# EAGLE design Placa_Rasp3 (EAGLE 9.1.3)
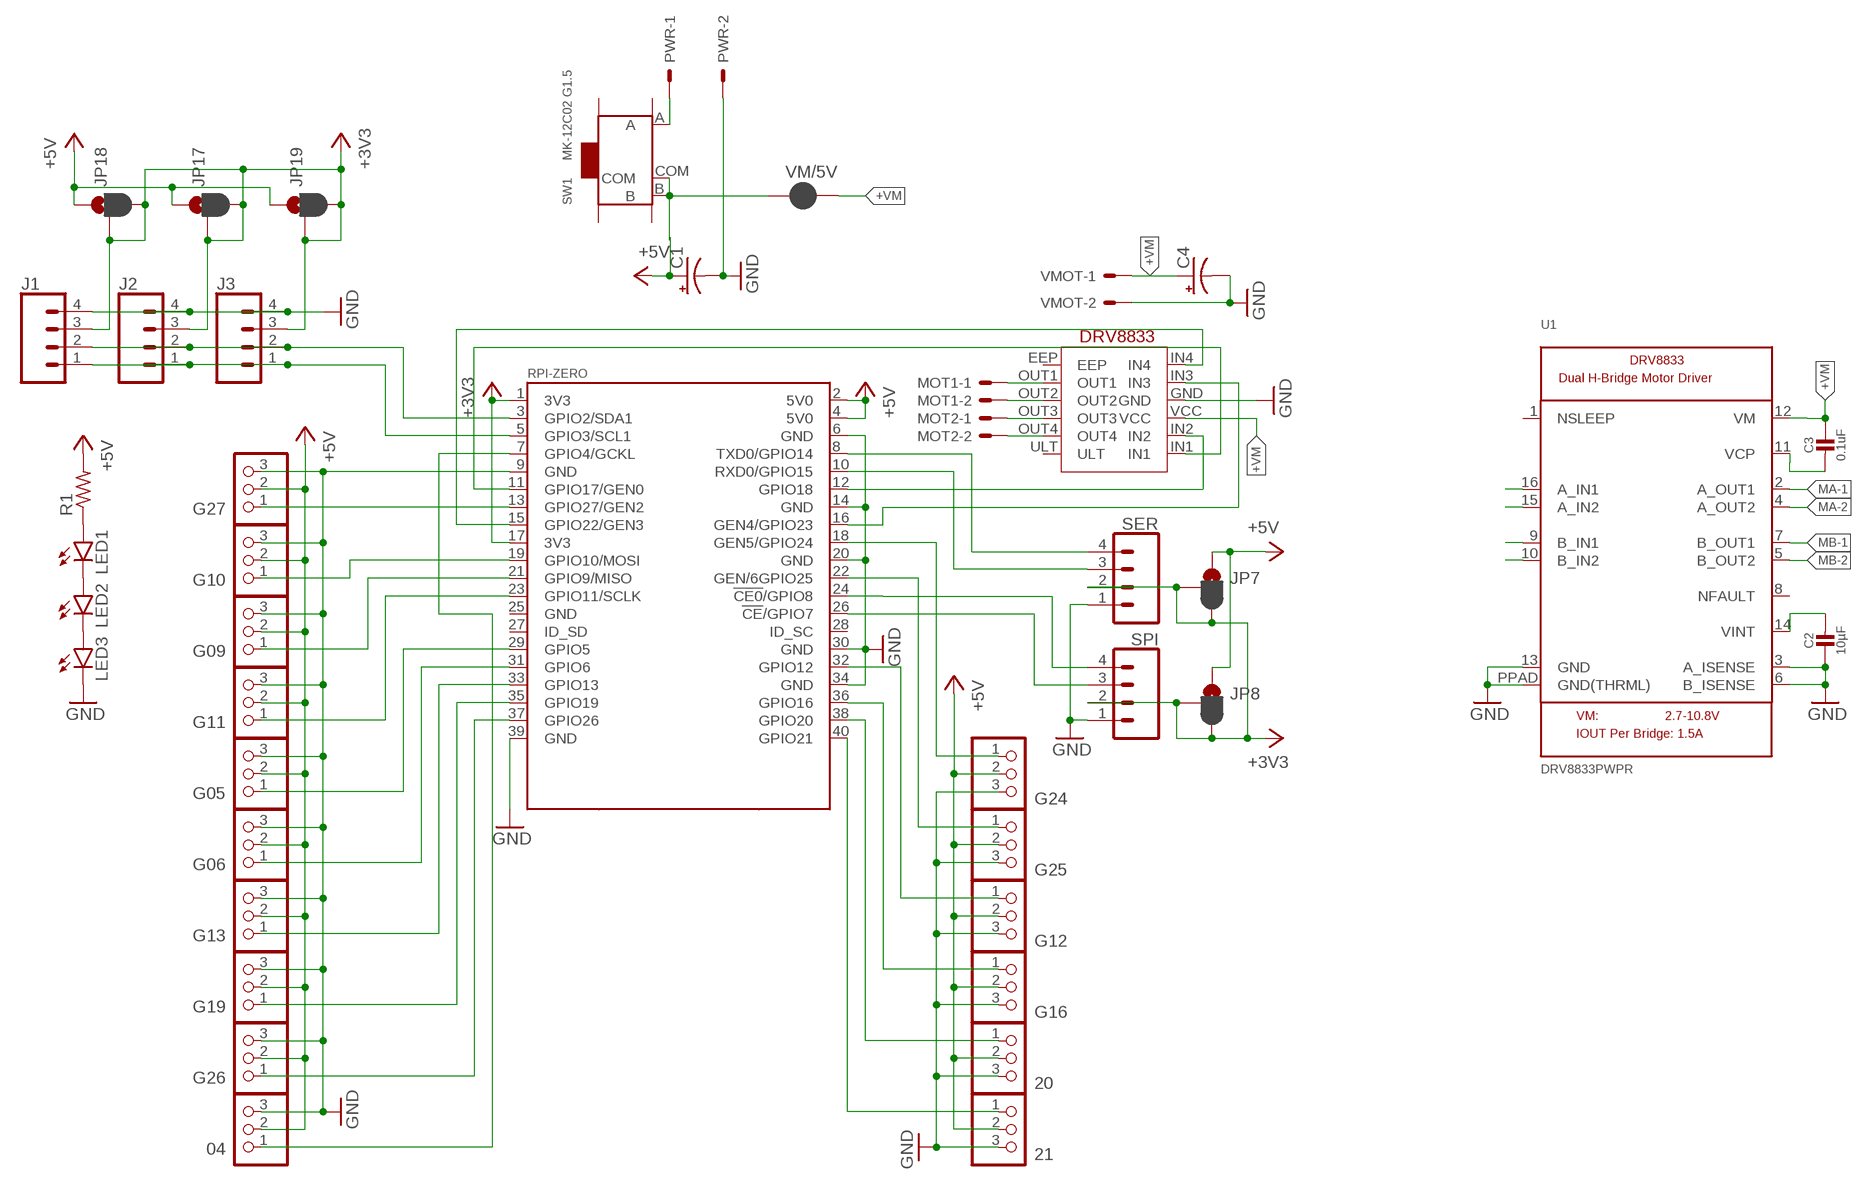
[diagram p0: schematic, sheet 1]

## Parts
04  PINHD-1X3  [1X03]
20  PINHD-1X3  [1X03]
21  PINHD-1X3  [1X03]
C1  CPOL-USE2,5-6E  [E2,5-6E]
C2  10µF  CAP_CERAMIC0805-NOOUTLINE  [0805-NO]
C3  0.1uF  CAP_CERAMIC0805-NOOUTLINE  [0805-NO]
C4  CPOL-USE2,5-6E  [E2,5-6E]
G05  PINHD-1X3  [1X03]
G06  PINHD-1X3  [1X03]
G09  PINHD-1X3  [1X03]
G10  PINHD-1X3  [1X03]
G11  PINHD-1X3  [1X03]
G12  PINHD-1X3  [1X03]
G13  PINHD-1X3  [1X03]
G16  PINHD-1X3  [1X03]
G19  PINHD-1X3  [1X03]
G24  PINHD-1X3  [1X03]
G25  PINHD-1X3  [1X03]
G26  PINHD-1X3  [1X03]
G27  PINHD-1X3  [1X03]
J1  CONN_04  [1X04]
J2  CONN_04  [1X04]
J3  CONN_04  [1X04]
JP7  JUMPER-SMT_3_1-NC_PASTE_SILK  [SMT-JUMPER_3_1-NC_PASTE_SILK]
JP8  JUMPER-SMT_3_1-NC_PASTE_SILK  [SMT-JUMPER_3_1-NC_PASTE_SILK]
JP17  JUMPER-SMT_3_1-NC_PASTE_SILK  [SMT-JUMPER_3_1-NC_PASTE_SILK]
JP18  JUMPER-SMT_3_1-NC_PASTE_SILK  [SMT-JUMPER_3_1-NC_PASTE_SILK]
JP19  JUMPER-SMT_3_1-NC_PASTE_SILK  [SMT-JUMPER_3_1-NC_PASTE_SILK]
LED1  LEDCHIP-LED0603  [CHIP-LED0603]
LED2  LEDCHIP-LED0603  [CHIP-LED0603]
LED3  LEDCHIP-LED0603  [CHIP-LED0603]
MOT1  JST-XH-02-PIN-LONG-PAD  [JST-XH-02-PACKAGE-LONG-PAD]
MOT2  JST-XH-02-PIN-LONG-PAD  [JST-XH-02-PACKAGE-LONG-PAD]
PWR  JST-XH-02-PIN-LONG-PAD  [JST-XH-02-PACKAGE-LONG-PAD]
R1  R-US_R0603  [R0603]
SER  CONN_04  [1X04]
SPI  CONN_04  [1X04]
SW1  MK-12C02 G1.5  SMD-TOGGLE-SWITCH-ON-ON(3+4P-6.7X2.7MM)  [SW7-SMD-L6.7X2.7X3.2MM]
U1  DRV8833PWPR  DRV8833  [HTSSOP16]
U$1  RPI-ZERO  [RASPBERRYPI_BASTELSTUBE_V13_RASPI_BOARD_B+_FULL]
U$3  DVR8833  [DRV8833]
VM/5V  JUMPER-SMT_2_NC_PASTE_SILK  [SMT-JUMPER_2_NC_PASTE_SILK]
VMOT  JST-XH-02-PIN-LONG-PAD  [JST-XH-02-PACKAGE-LONG-PAD]

## Nets
+3V3: J1.3 J2.3 J3.3 JP7.2 JP7.3 JP8.2 JP8.3 JP17.2 JP17.3 JP18.2 JP18.3 JP19.2 JP19.3 SER.2 SPI.2 U$1.1(3V3) U$1.17(3V3)
+5V: 04.2 20.2 21.2 C1.+ G05.2 G06.2 G09.2 G10.2 G11.2 G12.2 G13.2 G16.2 G19.2 G24.2 G25.2 G26.2 G27.2 JP7.1 JP8.1 JP17.1 JP18.1 JP19.1 R1.2 SW1.B SW1.COM U$1.2(5V0) U$1.4(5V0) VM/5V.1
+VM: C3.1 C4.+ U1.12(VM) U$3.VCC VM/5V.2 VMOT.1
CS0: SPI.4 U$1.24(!CE0!/GPIO8)
CS1: SPI.3 U$1.26(!CE!/GPIO7)
G17: U$1.11(GPIO17/GEN0) U$3.IN1
G18: U$1.12(GPIO18) U$3.IN2
G22: U$1.15(GPIO22/GEN3) U$3.IN4
G23: U$1.16(GEN4/GPIO23) U$3.IN3
GND: 04.3 20.3 21.3 C1.- C2.1 C4.- G05.3 G06.3 G09.3 G10.3 G11.3 G12.3 G13.3 G16.3 G19.3 G24.3 G25.3 G26.3 G27.3 J1.4 J2.4 J3.4 LED3.C PWR.2 SER.1 SPI.1 U1.3(A_ISENSE) U1.6(B_ISENSE) U1.13(GND) U1.PPAD(GND(THRML)) U$1.6(GND) U$1.9(GND) U$1.14(GND) U$1.20(GND) U$1.30(GND) U$1.34(GND) U$1.39(GND) U$3.GND VMOT.2
MA-1: MOT1.1 U1.2(A_OUT1) U$3.OUT1
MA-2: MOT1.2 U1.4(A_OUT2) U$3.OUT2
MB-1: MOT2.2 U1.7(B_OUT1) U$3.OUT4
MB-2: MOT2.1 U1.5(B_OUT2) U$3.OUT3
N$1: G26.1 U$1.37(GPIO26)
N$2: G24.1 U$1.18(GEN5/GPIO24)
N$3: G25.1 U$1.22(GEN/6GPIO25)
N$4: G12.1 U$1.32(GPIO12)
N$5: G16.1 U$1.36(GPIO16)
N$6: PWR.1 SW1.A
N$7: 20.1 U$1.38(GPIO20)
N$8: 21.1 U$1.40(GPIO21)
N$9: LED1.C LED2.A
N$10: LED2.C LED3.A
N$11: U1.16(A_IN1)
N$12: U1.15(A_IN2)
N$13: LED1.A R1.1
N$14: U1.9(B_IN1)
N$18: G27.1 U$1.13(GPIO27/GEN2)
N$19: G10.1 U$1.19(GPIO10/MOSI)
N$20: G11.1 U$1.23(GPIO11/SCLK)
N$21: G09.1 U$1.21(GPIO9/MISO)
N$22: G05.1 U$1.29(GPIO5)
N$23: G06.1 U$1.31(GPIO6)
N$24: G13.1 U$1.33(GPIO13)
N$25: G19.1 U$1.35(GPIO19)
N$26: 04.1 U$1.7(GPIO4/GCKL)
N$29: U1.10(B_IN2)
N$34: C2.2 U1.14(VINT)
N$35: C3.2 U1.11(VCP)
RX: SER.3 U$1.10(RXD0/GPIO15)
SCL: J1.1 J2.1 J3.1 U$1.5(GPIO3/SCL1)
SDA: J1.2 J2.2 J3.2 U$1.3(GPIO2/SDA1)
TX: SER.4 U$1.8(TXD0/GPIO14)
Unconnected: SW1.SS1 SW1.SS2 SW1.SS3 SW1.SS4 U1.1(NSLEEP) U1.8(NFAULT) U$1.25(GND) U$1.27(ID_SD) U$1.28(ID_SC) U$3.EEP U$3.ULT

## Library data of the parts
04 20 21 G05 G06 G09 G10-G13 G16 G19 G24-G27 = Placa_Rasp2:PINHD-1X3: PIN HEADER
C1 C4 = Placa_Rasp2:CPOL-US: POLARIZED CAPACITOR, American symbol; SPICEPREFIX: C
C2 C3 = Placa_Rasp2:CAP_CERAMIC: Ceramic Capacitors For new designs, use the packages preceded by an '_' character since they are more reliable: The following footprints should be used on most boards: _0402 - Standard footprint for regular board layouts _0603 - Standard footprint for regular board layouts _0805 - Standard footprint for regular board layouts _1206 - Standard footprint for regular board layouts For extremely tight-pitch boards where space is at a premium, the following 'micro-pitch' footprints can be used (smaller pads, no silkscreen outline, etc.): _0402MP - Micro-pitch footprint for very dense/compact boards _0603MP - Micro-pitch footprint for very dense/compact boards _0805MP - Micro-pitch footprint for very dense/compact boards _1206MP - Micro-pitch footprint for very dense/compact boards
J1-J3 SER SPI = Placa_Rasp2:CONN_04: Multi connection point. Often used as Generic Header-pin footprint for 0.1 inch spaced/style header connections On any of the 0.1 inch spaced packages, you can populate with these: Break Away Headers - Straight <https://www.sparkfun.com/products/116> (PRT-00116) Break Away Male Headers - Right Angle <https://www.sparkfun.com/products/553> (PRT-00553) Female Headers <https://www.sparkfun.com/products/115> (PRT-00115) Break Away Headers - Machine Pin <https://www.sparkfun.com/products/117> (PRT-00117) Break Away Female Headers - Swiss Machine Pin <https://www.sparkfun.com/products/743> (PRT-00743) For SCREWTERMINALS and SPRING TERMINALS visit here: Screw Terimnals on SparkFun.com <https://www.sparkfun.com/search/results?term=Screw+Terminals> (5mm/3.5mm/2.54mm spacing) This device is also useful as a general connection point to wire up your design to another part of your project. Our various solder wires solder well into these plated through hole pads. Hook-Up Wire - Assortment (Stranded, 22 AWG) <https://www.sparkfun.com/products/11375> (PRT-11375) Hook-Up Wire - Assortment (Solid Core, 22 AWG) <https://www.sparkfun.com/products/11367> (PRT-11367) View the entire wire category on our website here <https://www.sparkfun.com/categories/141> Special notes: Molex polarized connector foot print use with SKU : PRT-08231 with associated crimp pins and housings. 1MM SMD Version SKU: PRT-10208; PROD_ID: CONN-09696
JP7 JP8 JP17-JP19 = Placa_Rasp2:JUMPER-SMT_3_1-NC_PASTE: Normally closed solder jumper (1 of 2 connections) This jumper has an aperture in the stencil to allow solder paste to bridge one of the two connections. One connection is normally closed (NC), while the other is normally open (NO). Wick off the solder to open the connection. Reapply solder to reclose the connection. Apply solder to the other side instead to change the current path.
LED1-LED3 = led:LED: LED OSRAM: - CHIPLED LG R971, LG N971, LY N971, LG Q971, LY Q971, LO R971, LY R971 LH N974, LH R974 LS Q976, LO Q976, LY Q976 LO Q996 - Hyper CHIPLED LW Q18S LB Q993, LB Q99A, LB R99A - SideLED LS A670, LO A670, LY A670, LG A670, LP A670 LB A673, LV A673, LT A673, LW A673 LH A674 LY A675 LS A676, LA A676, LO A676, LY A676, LW A676 LS A679, LY A679, LG A679 - Hyper Micro SIDELED® LS Y876, LA Y876, LO Y876, LY Y876 LT Y87S - SmartLED LW L88C, LW L88S LB L89C, LB L89S, LG L890 LS L89K, LO L89K, LY L89K LS L896, LA L896, LO L896, LY L896 - TOPLED LS T670, LO T670, LY T670, LG T670, LP T670 LSG T670, LSP T670, LSY T670, LOP T670, LYG T670 LG T671, LOG T671, LSG T671 LB T673, LV T673, LT T673, LW T673 LH T674 LS T676, LA T676, LO T676, LY T676, LB T676, LH T676, LSB T676, LW T676 LB T67C, LV T67C, LT T67C, LS T67K, LO T67K, LY T67K, LW E67C LS E67B, LA E67B, LO E67B, LY E67B, LB E67C, LV E67C, LT E67C LW T67C LS T679, LY T679, LG T679 LS T770, LO T770, LY T770, LG T770, LP T770 LB T773, LV T773, LT T773, LW T773 LH T774 LS E675, LA E675, LY E675, LS T675 LS T776, LA T776, LO T776, LY T776, LB T776 LHGB T686 LT T68C, LB T68C - Hyper Mini TOPLED® LB M676 - Mini TOPLED Santana® LG M470 LS M47K, LO M47K, LY M47K Source: http://www.osram.convergy.de LUXEON: - LUMILED® LXK2-PW12-R00, LXK2-PW12-S00, LXK2-PW14-U00, LXK2-PW14-V00 LXK2-PM12-R00, LXK2-PM12-S00, LXK2-PM14-U00 LXK2-PE12-Q00, LXK2-PE12-R00, LXK2-PE12-S00, LXK2-PE14-T00, LXK2-PE14-U00 LXK2-PB12-K00, LXK2-PB12-L00, LXK2-PB12-M00, LXK2-PB14-N00, LXK2-PB14-P00, LXK2-PB14-Q00 LXK2-PR12-L00, LXK2-PR12-M00, LXK2-PR14-Q00, LXK2-PR14-R00 LXK2-PD12-Q00, LXK2-PD12-R00, LXK2-PD12-S00 LXK2-PH12-R00, LXK2-PH12-S00 LXK2-PL12-P00, LXK2-PL12-Q00, LXK2-PL12-R00 Source: www.luxeon.com KINGBRIGHT: KA-3528ASYC Source: www.kingbright.com
MOT1 MOT2 PWR VMOT = Placa_Rasp2:JST-XH-02-PIN: JST XH Connector 2 Pin Wire to board connector. Pitch: 2,54 mm, (0.100") Number of pins: 2 Created by Rembrandt Electronics www.rembrandtelectronics.com
R1 = rcl:R-US_: RESISTOR, American symbol; SPICEPREFIX: R
SW1 = Placa_Rasp2:SMD-TOGGLE-SWITCH-ON-ON(3+4P-6.7X2.7MM): 311030001; MPN: MK-12C02 G1.5
U1 = Placa_Rasp2:DRV8833: DRV8833 Dual H-Bridge Motor Driver -- HTSSOP Package
U$1 = Placa_Rasp2:RPI-ZERO
U$3 = Placa_Rasp2:DVR8833
VM/5V = Placa_Rasp2:JUMPER-SMT_2_NC_PASTE: Normally closed solder jumper This jumper has an aperture in the stencil to allow solder paste to bridge the split in the wire so it's normally closed (NC). Wick off the solder to open the connection. Reapply solder to reclose the connection.

## Board
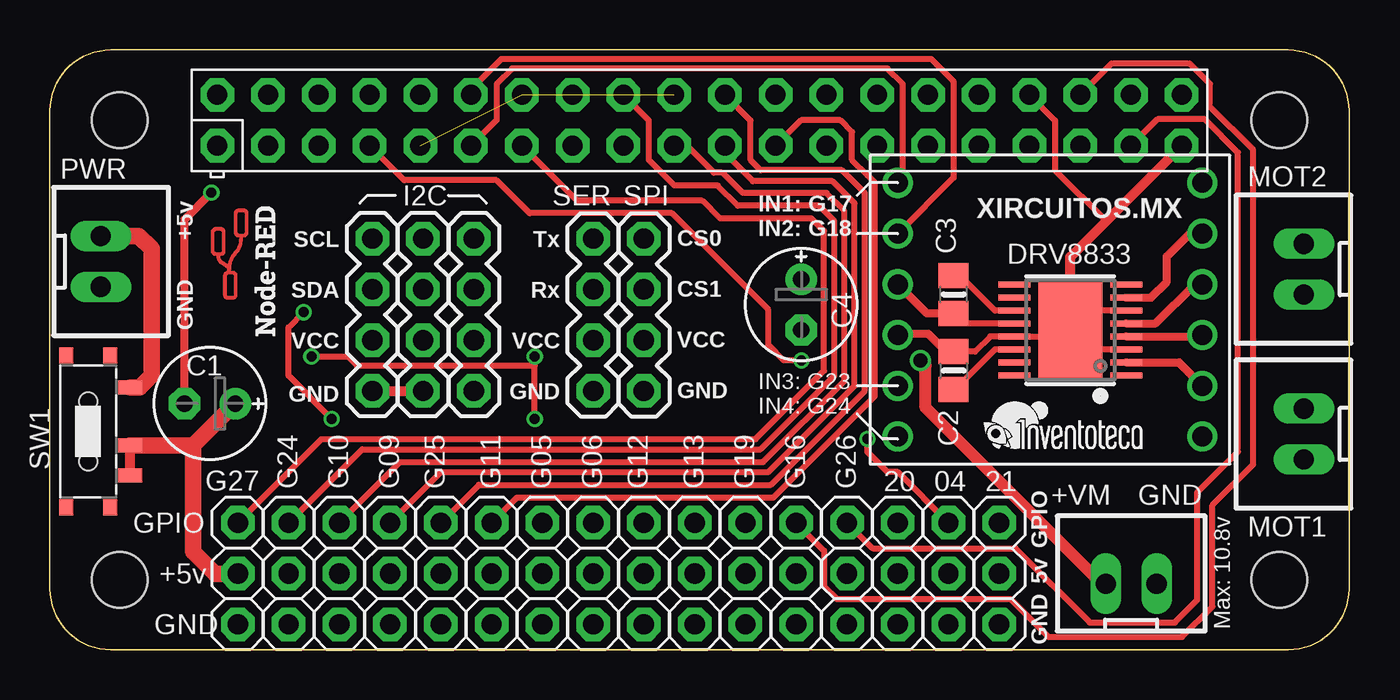
[diagram p1: board, top side]
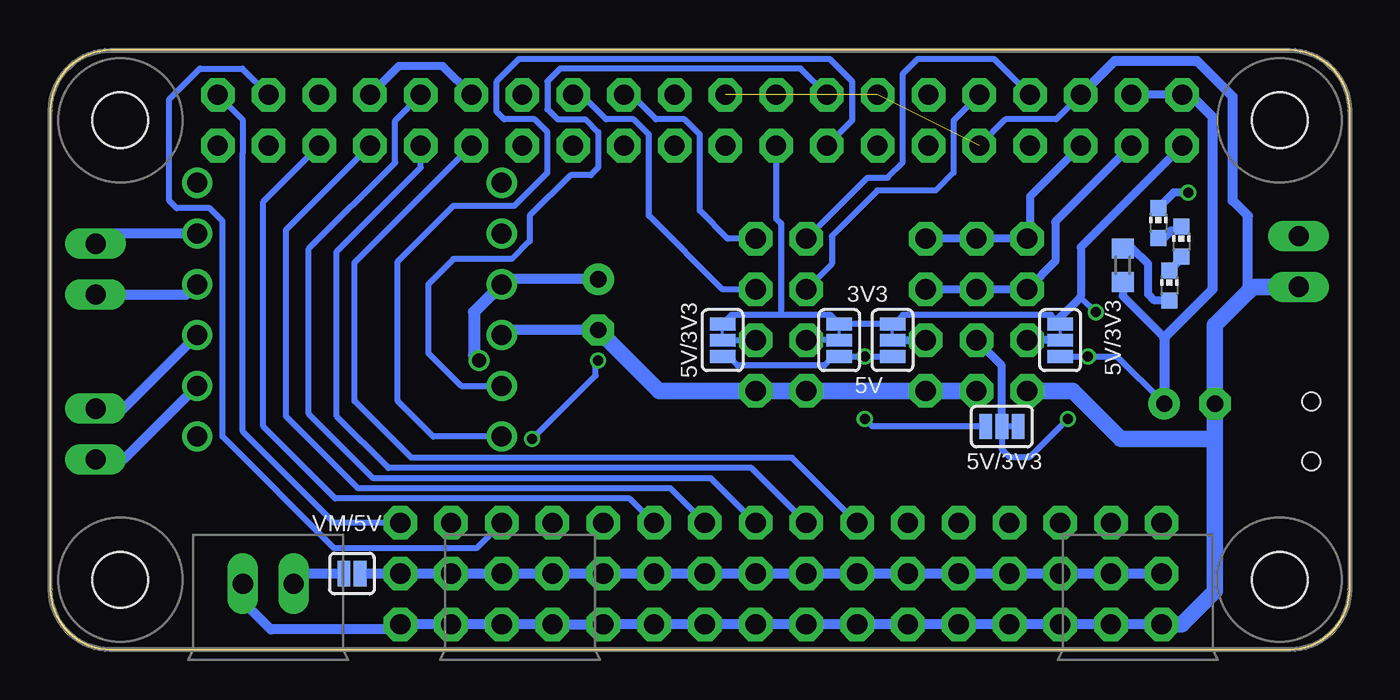
[diagram p2: board, bottom side, seen from below]

Size 65 x 30.02 mm. Coordinates in mm from the lower left corner, seen from the top.
Outline: 3.05,0 61.95,0 arc90 65,3.05 65,26.97 arc90 61.95,30.02 3.05,30.02 arc90 0,26.97 0,3.05 arc90 3.05,0
Copper layers (1*16): Top 0.035mm / dielectric 1.5mm / Bottom 0.035mm
Design rules "_xircuitos.mx_2L_DRC": minimum track width 6mil, minimum drill 12mil, track to track 6mil, track to pad 6mil, pad to pad 6mil, via to via 6mil, smd to smd 0mil, copper to edge 10mil, drill to drill 12mil, minimum pad ring 10mil, minimum via ring 6mil, stop-mask expansion 2mil, vias tented up to drill 100mil, thermal gap 10mil
Holes 2.8 mm at 3.5,26.5 3.5,3.5 61.5,26.5 61.5,3.5

### Footprints (pad centres in the part's own frame; a part is rotated, then mirrored left to right if it is on the bottom)
1X03 = drill 1.016 pad 1.676 octagon: 1 -2.54,0; 2 0,0; 3 2.54,0
E2,5-6E = drill 0.813 pad 1.575: + -1.27,0 | drill 0.813 pad 1.575 octagon: - 1.27,0
0805-NO = smd 1.24 x 1.5: 1 -0.95,0; 2 0.95,0
1X04 = drill 1.016 pad 1.676 octagon: 1 0,0; 2 2.54,0; 3 5.08,0; 4 7.62,0
SMT-JUMPER_3_1-NC_PASTE_SILK = smd 0.635 x 1.27: 1 -0.813,0; 2 0,0; 3 0.813,0
CHIP-LED0603 = smd 0.8 x 0.8: A 0,-0.75; C 0,0.75
JST-XH-02-PACKAGE-LONG-PAD = drill 1.016 long: 1 -1.27,0; 2 1.27,0
R0603 = smd 1 x 1.1: 1 -0.85,0; 2 0.85,0
SW7-SMD-L6.7X2.7X3.2MM = smd 1.2 x 0.7: A 2.1,2.2; B 2.1,-2.2; COM 2.1,-0.7 | smd 0.7 x 0.8: SS1 -1.1,-3.8; SS2 1.1,-3.8; SS3 1.1,3.8; SS4 -1.1,3.8 | hole 0.9: 0,-1.5; 0,1.5
HTSSOP16 = smd 0.3 x 1.6: 1 -2.275,-2.8; 2 -1.625,-2.8; 3 -0.975,-2.8; 4 -0.325,-2.8; 5 0.325,-2.8; 6 0.975,-2.8; 7 1.625,-2.8; 8 2.275,-2.8; 9 2.275,2.8; 10 1.625,2.8; 11 0.975,2.8; 12 0.325,2.8; 13 -0.325,2.8; 14 -0.975,2.8; 15 -1.625,2.8; 16 -2.275,2.8 | smd 4.8 x 3.2: PPAD 0,0
RASPBERRYPI_BASTELSTUBE_V13_RASPI_BOARD_B+_FULL = drill 1 pad 1.676 octagon: 1 8.37,25.23; 2 8.37,27.77; 3 10.91,25.23; 4 10.91,27.77; 5 13.45,25.23; 6 13.45,27.77; 7 15.99,25.23; 8 15.99,27.77; 9 18.53,25.23; 10 18.53,27.77; 11 21.07,25.23; 12 21.07,27.77; 13 23.61,25.23; 14 23.61,27.77; 15 26.15,25.23; 16 26.15,27.77; 17 28.69,25.23; 18 28.69,27.77; 19 31.23,25.23; 20 31.23,27.77; 21 33.77,25.23; 22 33.77,27.77; 23 36.31,25.23; 24 36.31,27.77; 25 38.85,25.23; 26 38.85,27.77; 27 41.39,25.23; 28 41.39,27.77; 29 43.93,25.23; 30 43.93,27.77; 31 46.47,25.23; 32 46.47,27.77; 33 49.01,25.23; 34 49.01,27.77; 35 51.55,25.23; 36 51.55,27.77; 37 54.09,25.23; 38 54.09,27.77; 39 56.63,25.23; 40 56.63,27.77 | hole 2.75: 3.5,3.5; 3.5,26.5; 61.5,3.5; 61.5,26.5
DRV8833 = drill 1: EEP -7.62,5.08; GND 7.62,0; IN1 7.62,-7.62; IN2 7.62,-5.08; IN3 7.62,2.54; IN4 7.62,5.08; OUT1 -7.62,2.54; OUT2 -7.62,0; OUT3 -7.62,-2.54; OUT4 -7.62,-5.08; ULT -7.62,-7.62; VCC 7.62,-2.54
SMT-JUMPER_2_NC_PASTE_SILK = smd 0.635 x 1.27: 1 -0.406,0; 2 0.406,0

### Placement (x,y rotation side)
04  44.96,3.81 270 top
20  42.42,3.81 270 top
21  47.5,3.81 270 top
C1  8,12.32 180 top
C2  45.21,13.97 270 top
C3  45.21,17.78 90 top
C4  37.59,17.27 270 top
G05  24.64,3.81 270 top
G06  27.18,3.81 270 top
G09  17.02,3.81 270 top
G10  14.48,3.81 270 top
G11  22.1,3.81 270 top
G12  29.72,3.81 270 top
G13  32.26,3.81 270 top
G16  37.34,3.81 270 top
G19  34.8,3.81 270 top
G24  11.94,3.81 270 top
G25  19.56,3.81 270 top
G26  39.88,3.81 270 top
G27  9.4,3.81 270 top
J1  21.21,20.57 270 top
J2  18.67,20.57 270 top
J3  16.13,20.57 270 top
JP7  31.37,15.49 90 bottom
JP8  25.53,15.49 90 bottom
JP17  17.4,11.18 0 bottom
JP18  14.48,15.49 90 bottom
JP19  22.86,15.49 90 bottom
LED1  9.02,18.24 0 bottom
LED2  8.42,20.43 0 bottom
LED3  9.58,21.36 0 bottom
MOT1  62.74,10.79 90 top
MOT2  62.74,19.05 90 top
PWR  2.54,19.43 270 top
R1  11.35,19.24 270 bottom
SER  27.18,12.95 90 top
SPI  29.72,12.95 90 top
SW1  1.91,10.92 0 top
U1  51.05,16 90 top
U$1  0,0 0 top
U$3  50.04,15.75 180 top
VM/5V  49.91,3.81 180 bottom
VMOT  54.1,3.3 0 top

### Tracks (layer width: path | path; a pad name or v marks a point on that pad's centre or on a via)
+3V3  (via drill 0.5)
  Top 0.305: v14.1,11.56 11.94,13.72 11.94,16.13 v12.7,16.89
  Bottom 0.152: JP18.2 JP18.3 | JP19.2 22.86,16.26 JP19.3 | JP8.2 JP8.3 | JP7.2 JP7.3
  Bottom 0.305: JP18.3 14.64,16.47 14.94,16.76 22.35,16.76 22.86,16.26 | JP19.3 JP8.3 25.98,16.76 28.45,16.76 | JP7.3 30.91,16.76 28.45,16.76 | U$1.17 28.69,21.58 28.45,21.34 28.45,16.76 | JP17.3 JP17.2 17.4,10.03 17.02,9.65 16,9.65 v14.1,11.56 | v12.7,16.89 13.4,17.59 13.53,17.59 | JP7.2 SPI.2 | JP8.2 SER.2
  Bottom 0.406: JP18.2 J3.3 | JP19.2 J1.3 | JP17.2 17.4,14.22 J2.3 | 14.64,16.47 13.53,17.59 13.45,17.66 13.45,20.15 U$1.1
+5V  (via drill 0.5)
  Top 0.305: v24.26,11.56 24.26,14.22 | 24.26,14.22 v24.26,14.68 | v13.08,14.68 14.91,14.68 15.37,14.22 24.26,14.22
  Top 0.508: SW1.B SW1.COM
  Top 0.813: SW1.COM 7.17,10.22 | 7.17,10.22 C1.+ | 7.17,10.22 7.17,4.89 8.26,3.81 G27.2
  Bottom 0.305: JP7.1 31.06,14.68 30.61,14.22 26.29,14.22 25.83,14.68 JP8.1 v24.26,14.68 JP19.1 | JP18.1 v13.08,14.68 11.63,14.68 C1.+ | JP17.1 23.88,11.18 v24.26,11.56
  Bottom 0.406: U$1.2 U$1.4 | R1.2 11.35,17.7 9.27,15.62
  Bottom 0.508: G27.2 G24.2 G10.2 G09.2 G25.2 G11.2 G05.2 G06.2 G12.2 G13.2 G19.2 G16.2 G26.2 20.2 04.2 21.2 VM/5V.1 | U$1.2 7.96,27.77 6.86,26.67 6.86,18.03 9.27,15.62 C1.+
+VM  (via drill 0.7)
  Top 0.305: U1.12 45.72,16.33 C3.1
  Top 0.406: C3.1 43.88,16.83 U$3.VCC
  Top 0.61: v43.56,14.48 43.81,14.22 43.81,12.12 52.63,3.3 VMOT.1
  Bottom 0.406: 42.16,18.54 U$3.VCC
  Bottom 0.508: VM/5V.2 52.32,3.81 VMOT.1 | C4.+ 42.16,18.54
  Bottom 0.61: U$3.VCC 43.81,16.89 43.81,14.73 v43.56,14.48
CS0
  Bottom 0.305: SPI.4 31.11,20.57 32.51,21.97 32.51,25.78 33.27,26.54 34.7,26.54 35.93,27.77 U$1.24
CS1
  Bottom 0.305: SPI.3 31.37,18.03 35.05,21.72 35.05,25.78 35.81,26.54 37.2,26.54 38.43,27.77 U$1.26
G17
  Top 0.305: U$3.IN1 42.67,23.62 42.67,28.32 41.91,29.08 23.11,29.08 22.35,28.32 22.35,26.51 U$1.11
G18
  Top 0.305: U$1.12 21.07,28.05 22.59,29.58 44.08,29.58 45.21,28.45 45.21,23.62 U$3.IN2
G22
  Bottom 0.305: U$3.IN4 45.85,10.67 47.62,12.45 47.62,19.43 44.83,22.23 41.78,22.23 40.13,23.88 40.13,25.91 40.77,26.54 42.29,26.54 42.67,26.92 42.67,28.45 41.54,29.58 26.02,29.58 24.89,28.45 24.89,26.49 U$1.15
G23
  Bottom 0.305: U$1.16 27.46,29.08 39.5,29.08 40.13,28.45 40.13,27.05 39.62,26.54 38.23,26.54 37.59,25.91 37.59,24.13 37.97,23.75 38.99,23.75 41.02,21.72 41.02,20.45 41.91,19.56 44.83,19.56 46.1,18.29 46.1,14.86 44.45,13.21 U$3.IN3
GND  (via drill 0.5)  (2 unrouted)
  Top 0.305: U1.6 52.03,16.98 | U1.3 52.16,15.03 | U1.PPAD 50.73,15.68 U1.13 47.05,15.68 46.29,14.92 C2.1 | U$1.34 50.29,26.49 50.29,24 52.85,21.45
  Top 0.406: 52.03,16.98 51.12,16.07 | 51.12,16.07 U1.PPAD | 52.16,15.03 51.12,16.07 | C2.1 44.83,14.92 43.94,15.81 42.48,15.81 U$3.GND | C1.- 6.73,21.54 v8.08,22.89
  Top 0.508: J3.4 J2.4 | U1.PPAD 51.05,19.65 52.85,21.45 U$1.39
  Bottom 0.305: U$1.6 14.68,26.54 17.22,26.54 U$1.9
  Bottom 0.406: 42.16,16 U$3.GND | U$1.30 45.37,29.21 47.57,29.21 U$1.34 | v8.08,22.89 8.8,22.89 LED3.C
  Bottom 0.508: G27.3 G24.3 G10.3 G09.3 G25.3 G11.3 G05.3 G06.3 G12.3 G13.3 G19.3 G16.3 G26.3 20.3 04.3 21.3 47.75,1.02 53.98,1.02 55.37,2.41 VMOT.2 | C4.- 42.16,16 | U$1.6 11.75,29.47 11.74,29.46 7.62,29.46 5.84,27.69 5.84,22.48 5.08,21.72 5.08,17.91
  Bottom 0.813: 6.73,10.54 C1.- 6.73,16.26 5.08,17.91 4.83,18.16 PWR.2 | 6.73,10.54 6.73,2.92 8.38,1.27 G27.3 | 6.73,10.54 11.43,10.54 13.84,12.95 J3.4 | J2.4 J1.4 SPI.1 SER.1 34.54,12.95 C4.-
MA-1
  Top 0.406: U1.2 56.49,14.38 U$3.OUT1
  Bottom 0.508: U$3.OUT1 61.34,9.53 MOT1.1
MA-2
  Top 0.406: U1.4 57.59,15.68 U$3.OUT2
  Bottom 0.508: U$3.OUT2 61.34,12.06 MOT1.2
MB-1
  Top 0.406: U1.7 55.09,17.63 55.88,18.41 55.88,19.68 57.02,20.83 U$3.OUT4
  Bottom 0.508: U$3.OUT4 62.23,20.83 MOT2.2
MB-2
  Top 0.406: U1.5 55.32,16.33 57.28,18.29 U$3.OUT3
  Bottom 0.508: MOT2.1 58.17,17.78 U$3.OUT3
N$1
  Top 0.305: G26.1 41.15,5.08 48.31,5.08 52.02,1.37 56.29,1.37 57.4,2.49 57.4,7.87 59.44,9.91 59.44,24.89 57.78,26.54 55.4,26.54 U$1.37
N$2
  Top 0.305: G24.1 15.62,10.03 35.56,10.03 39.24,13.72 39.24,21.46 38.48,22.23 34.42,22.23 33.4,23.24 31.24,23.24 29.97,24.51 29.97,26.49 U$1.18
N$3
  Top 0.305: G25.1 21.46,8.26 36.07,8.26 40.77,12.95 40.77,18.8 40.77,20.32 40.77,22.86 39.62,24 35.56,24 35.05,24.51 35.05,26.49 U$1.22
N$4
  Bottom 0.305: G12.1 31.95,8.59 48.84,8.59 52.07,11.81 52.07,20.07 47.75,24.38 47.75,26.49 U$1.32
N$5
  Top 0.305: G16.1 38.73,4.95 38.73,3.17 39.37,2.54 48.06,2.54 49.96,0.64 56.64,0.64 58.17,2.16 58.17,7.24 60.2,9.27 60.2,25.02 58.04,27.18 58.04,28.32 57.02,29.34 53.12,29.34 U$1.36
N$6
  Top 0.813: SW1.A 4.49,13.12 5.08,13.72 5.08,20.07 4.45,20.7 PWR.1
N$7
  Bottom 0.305: 20.1 43.69,5.08 50.8,5.08 56.39,10.67 56.39,21.46 57.02,22.1 58.67,22.1 59.05,22.48 59.05,27.56 57.53,29.08 55.4,29.08 U$1.38
N$8
  Bottom 0.305: U$1.40 55.36,26.5 55.36,24.88 55.37,24.87 55.37,10.92 50.8,6.35 21.1
N$9
  Bottom 0.406: LED1.C 8.42,19.58 LED2.A
N$10
  Bottom 0.406: LED2.C 8.62,20.98 8.93,20.98 9.3,20.61 LED3.A
N$13
  Bottom 0.406: LED1.A 9.77,17.49 10.07,17.79 10.07,19.3 10.86,20.09 R1.1
N$18
  Top 0.305: G27.1 13.59,10.54 35.31,10.54 38.73,13.97 38.73,20.95 38.1,21.59 33.53,21.59 32.64,22.48 26.36,22.48 U$1.13
N$19
  Top 0.305: G10.1 17.53,9.4 35.69,9.4 39.75,13.46 39.75,21.97 38.86,22.86 34.67,22.86 33.66,23.88 33.22,23.88 31.86,25.23 U$1.19
N$20
  Top 0.305: G11.1 23.37,7.62 36.2,7.62 41.27,12.7 41.27,23.19 41.27,23.37 40.89,23.75 40.13,24.51 40.13,25.91 39.54,26.5 37.58,26.5 U$1.23
N$21
  Top 0.305: G09.1 19.56,8.89 35.94,8.89 40.26,13.21 40.26,22.35 39.16,23.45 35.17,23.45 33.77,24.85 U$1.21
N$22
  Bottom 0.305: G05.1 27.89,9.6 46.94,9.6 49.78,12.45 49.78,19.38 U$1.29
N$23
  Bottom 0.305: G06.1 29.92,9.09 48.08,9.09 50.67,11.68 50.67,19.94 46.47,24.14 U$1.31
N$24
  Bottom 0.305: G13.1 33.98,8.08 49.61,8.08 53.21,11.68 53.21,21.03 U$1.33
N$25
  Bottom 0.305: G19.1 36.02,7.57 50.75,7.57 54.36,11.18 54.36,22.42 U$1.35
N$26  (via drill 0.5)
  Top 0.305: 04.1 42.42,8.89 41.91,8.89 40.89,9.91 v40.89,10.54 | U$1.7 17.73,23.5 22.35,23.5 24,21.84 31.11,21.84 35.94,17.02 35.94,15.24 36.7,14.48 v37.59,14.48
  Bottom 0.305: v40.89,10.54 37.72,13.72 37.72,14.35 v37.59,14.48
N$34
  Top 0.305: U1.14 47.28,15.03 45.28,13.02 C2.2
N$35
  Top 0.305: U1.11 47.28,16.98 45.53,18.73 C3.2
RX
  Bottom 0.305: U$1.10 19.81,26.49 19.81,23.88 20.7,22.99 23.62,22.99 25.91,20.7 25.91,19.3 SER.3
SCL
  Bottom 0.406: J1.1 J2.1 J3.1 15.99,20.71 15.99,22.69 U$1.5
SDA
  Bottom 0.406: J1.2 J2.2 J3.2 14.72,19.44 14.72,21.42 U$1.3
TX
  Bottom 0.305: SER.4 24.13,23.62 23.11,23.62 22.35,24.38 22.35,28.83 21.61,29.58 17.8,29.58 U$1.8
(copper drawn outside any net)
  shapes: Top area x299

### Text on the board
tPlace: +5v | I2C | XIRCUITOS.MX | SCL | Tx | IN1: G17 / IN2: G18 | CS0 | GND | SDA | Rx | CS1 | VCC | VCC | VCC | GND | GND | GND | IN3: G23 / IN4: G24 | +VM | GND | GPIO | GPIO | +5v | 5v | GND | Max: 10.8v | GND
bPlace: 3V3 | 5V/3V3 | 5V/3V3 | 5V | 5V/3V3